# EAGLE design HeaterControl (EAGLE 9.2.0)
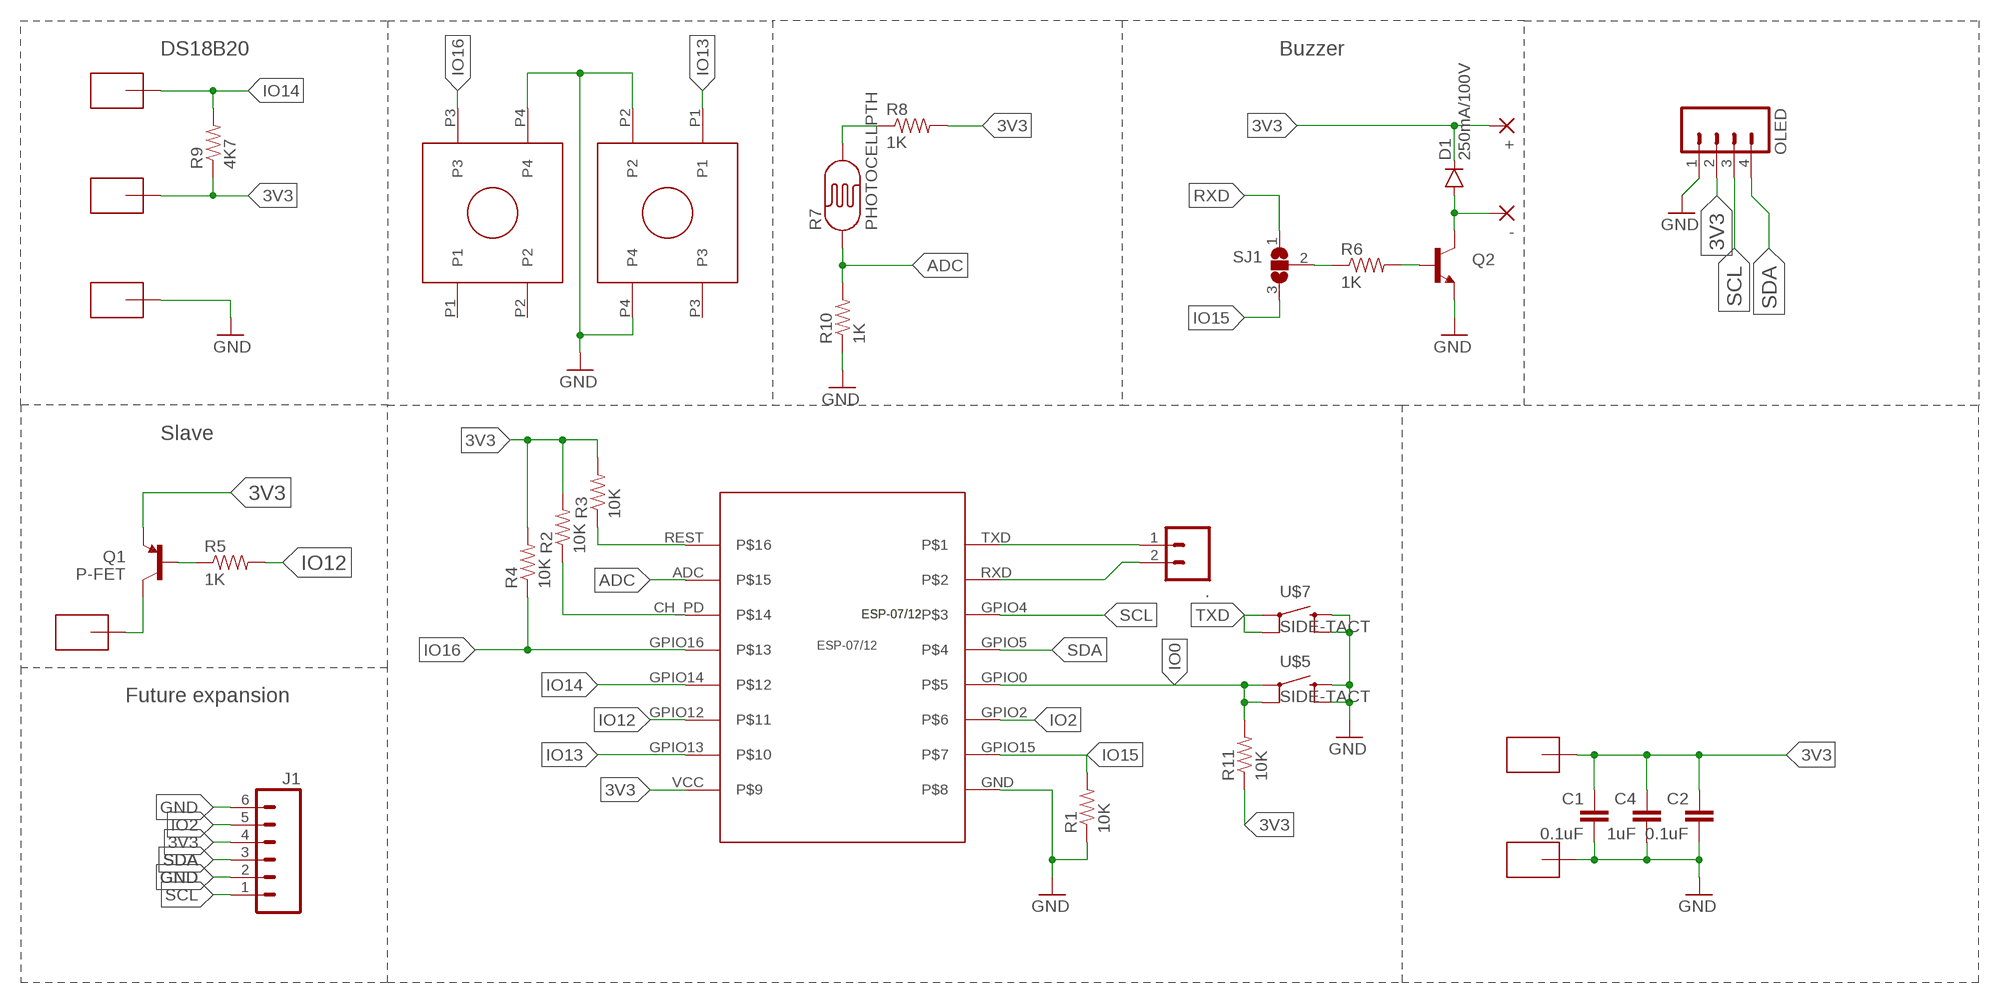
[diagram p0: schematic, sheet 1]

## Parts
+  1,6/0,8  [1,6/0,8]
-  1,6/0,8  [1,6/0,8]
.  M02PTH  [1X02]
C1  0.1uF  CAP  [0805-CAP]
C2  0.1uF  CAP  [0805-CAP]
C4  1uF  CAP  [0805-CAP]
D1  250mA/100V  DIODEBAS16  [SOD-323]
J1  M06SILK_FEMALE_PTH  [1X06]
LEFT  OMROM_TH  [OMROM_TH]
OLED  M04PTH  [1X04]
Q1  P-FET  TRANSISTOR_PNPSMD  [SOT23-3]
Q2  TRANSISTOR_NPNSOT23-3  [SOT23-3]
R1  10K  RESISTOR0805-RES  [0805]
R2  10K  RESISTOR0805-RES  [0805]
R3  10K  RESISTOR0805-RES  [0805]
R4  10K  RESISTOR0805-RES  [0805]
R5  1K  RESISTOR0805-RES  [0805]
R6  1K  RESISTOR0805-RES  [0805]
R7  PHOTOCELLPTH  [PHOTOCELL]
R8  1K  RESISTOR0805-RES  [0805]
R9  4K7  RESISTOR0805-RES  [0805]
R10  1K  RESISTOR0805-RES  [0805]
R11  10K  RESISTOR0805-RES  [0805]
RIGHT  OMROM_TH  [OMROM_TH]
SJ1  SJ2W  [SJ_2]
U$1  ESP-07/12  [ESP-07/12]
U$2  SMD-PAD1  [SMD-PAD1]
U$3  SMD-PAD1  [SMD-PAD1]
U$5  SIDE-TACT  [SIDE-TACT]
U$6  SMD-PAD1  [SMD-PAD1]
U$7  SIDE-TACT  [SIDE-TACT]
U$8  SMD-PAD1  [SMD-PAD1]
U$10  SMD-PAD1  [SMD-PAD1]
U$11  SMD-PAD1  [SMD-PAD1]

## Nets
3V3: +.1(P) C1.1 C2.1 C4.1 D1.C J1.4 OLED.2 Q1.2(E) R2.2 R3.2 R4.2 R8.2 R9.1 R11.1 U$1.VCC U$3.>NAME U$8.>NAME
ADC: R7.1 R10.2 U$1.ADC
GND: C1.2 C2.2 C4.2 J1.2 J1.6 LEFT.P4 OLED.1 Q2.2(E) R1.1 R10.1 RIGHT.P2 RIGHT.P4 U$1.GND U$5.3 U$5.4 U$6.>NAME U$7.3 U$7.4 U$11.>NAME
IO0: R11.2 U$1.GPIO0 U$5.1 U$5.2
IO2: J1.5 U$1.GPIO2
IO12: R5.2 U$1.GPIO12
IO13: RIGHT.P1 U$1.GPIO13
IO14: R9.2 U$1.GPIO14 U$10.>NAME
IO15: R1.2 SJ1.3 U$1.GPIO15
IO16: LEFT.P3 R4.1 U$1.GPIO16
N$1: Q1.3(C) U$2.>NAME
N$2: Q2.1(B) R6.2
N$4: -.1(P) D1.A Q2.3(C)
N$5: R7.2 R8.1
N$6: Q1.1(B) R5.1
N$8: R6.1 SJ1.2
N$11: R2.1 U$1.CH_PD
REST: R3.1 U$1.REST
RXD: ..2 SJ1.1 U$1.RXD
SCL: J1.1 OLED.3 U$1.GPIO4
SDA: J1.3 OLED.4 U$1.GPIO5
TXD: ..1 U$1.TXD U$7.1 U$7.2
Unconnected: LEFT.P1 LEFT.P2 RIGHT.P3

## Notes on the sheet
- DS18B20 | Buzzer
- Slave
- Future expansion

## Library data of the parts
+ - = wirepad:1,6/0,8: THROUGH-HOLE PAD
. = SparkFun-Connectors:M02: Standard 2-pin 0.1" header. Use with - straight break away headers ( PRT-00116) - right angle break away headers (PRT-00553) - swiss pins (PRT-00743) - machine pins (PRT-00117) - female headers (PRT-00115) Molex polarized connector foot print use with: PRT-08233 with associated crimp pins and housings. 2.54_SCREWTERM for use with PRT-10571. 3.5mm Screw Terminal footprints for PRT-08084 5mm Screw Terminal footprints for use with PRT-08432
C1 C2 C4 = SparkFun-Capacitors:CAP: Capacitor Standard 0603 ceramic capacitor, and 0.1" leaded capacitor.
D1 = SparkFun-DiscreteSemi:DIODE: Diode These are standard reverse protection diodes and small signal diodes. SMA package can handle up to about 1A. SOD-323 can handle about 200mA. What the SOD-323 package when ordering, there are some mfgs out there that are 5-pin packages.; PROD_ID: DIO-09646
J1 = SparkFun-Connectors:M06: Header 6 Standard 6-pin 0.1" header. Use with straight break away headers (SKU : PRT-00116), right angle break away headers (PRT-00553), swiss pins (PRT-00743), machine pins (PRT-00117), and female headers (PRT-00115). Molex polarized connector foot print use with SKU : PRT-08094 with associated crimp pins and housings. NOTES ON THE VARIANTS LOCK and LOCK_LONGPADS... This footprint was designed to help hold the alignment of a through-hole component (i.e. 6-pin header) while soldering it into place. You may notice that each hole has been shifted either up or down by 0.005 of an inch from it's more standard position (which is a perfectly straight line). This slight alteration caused the pins (the squares in the middle) to touch the edges of the holes. Because they are alternating, it causes a "brace" to hold the component in place. 0.005 has proven to be the perfect amount of "off-center" position when using our standard breakaway headers. Although looks a little odd when you look at the bare footprint, once you have a header in there, the alteration is very hard to notice. Also,if you push a header all the way into place, it is covered up entirely on the bottom side. This idea of altering the position of holes to aid alignment will be further integrated into the Sparkfun Library for other footprints. It can help hold any component with 3 or more connection pins.; PROD_ID: CONN-08437
LEFT RIGHT = CuriousTech:OMROM_TH: C&K KSA0M211 LFT + cap BTNK0120 (untested)
OLED = SparkFun-Connectors:M04: Header 4 Standard 4-pin 0.1" header. Use with straight break away headers (SKU : PRT-00116), right angle break away headers (PRT-00553), swiss pins (PRT-00743), machine pins (PRT-00117), and female headers (PRT-00115). Molex polarized connector foot print use with SKU : PRT-08231 with associated crimp pins and housings. 1MM SMD Version SKU: PRT-10208
Q1 = SparkFun-DiscreteSemi:TRANSISTOR_PNP: Generic PNP BJT Double check pinouts against datasheets- not all devices are the same! MMBT3906 - 40V 200mA SOT-23 (TRANS-08052) MMBT4403 - 40V 600mA SOT-23 (TRANS-09245)
Q2 = SparkFun-DiscreteSemi:TRANSISTOR_NPN: Generic NPN BJT MMBT2222A - TRANS-08049 (SOT-23, 1A 40V) MPSA42 - TRANS-09116 (SOT-23, 500mA 300V) MMBT5088LT1G - TRANS-11160 (SOT-23, 50 mA 30V) BC547 - COM-08928 <http://www.sparkfun.com/products/8928> (TO-92 45V 100mA) (1.Collector 2.Base 3.Emitter) 2N3904 - COM-00521 <http://www.sparkfun.com/products/521> (TO-92 40V 200mA) (1.Emitter 2.Base 3.Collector) P2N2222A - COM-12852 <http://www.sparkfun.com/products/12852> (TO-92 40V 600mA) (1.Collector 2.Base 3.Emitter); PROD_ID: TRANS-08049
R1-R6 R8-R11 = SparkFun-Resistors:RESISTOR: Resistor Basic schematic elements and footprints for 0603, 1206, and PTH resistors.
R7 = SparkFun-Sensors:PHOTOCELL: CdS photoresistor. This is a low cost way to detect light levels. Resistance decreases with more incoming light. SparkFun SKU: SEN-09088
SJ1 = jumper:SJ2W: SMD solder JUMPER
U$1 = ESP-07_12:ESP-07/12: Version 1.0 of the library for the ESP-07/12 full GPIO dev board module byME Jon jonnyradu@gmail.com
U$2 U$3 U$6 U$8 U$10 U$11 = CuriousTech:SMD-PAD1: SMD-PAD small
U$5 U$7 = CuriousTech:SIDE-TACT

## Board
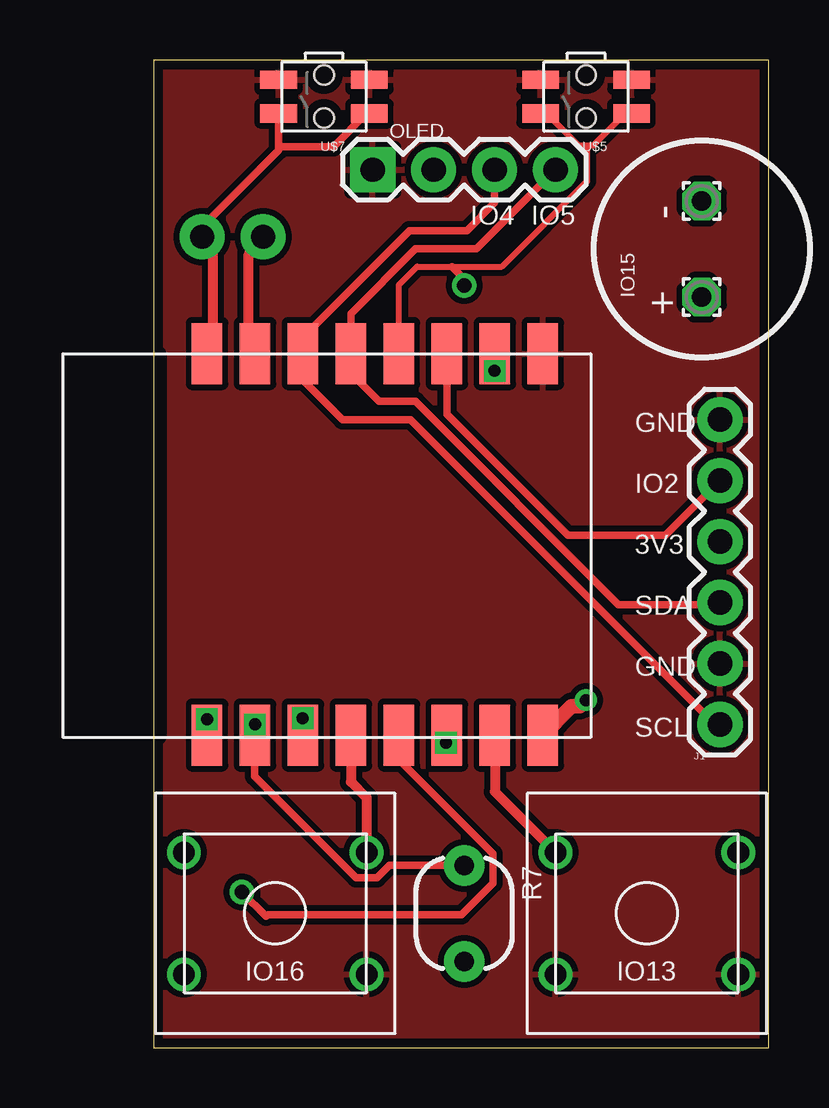
[diagram p1: board, top side]
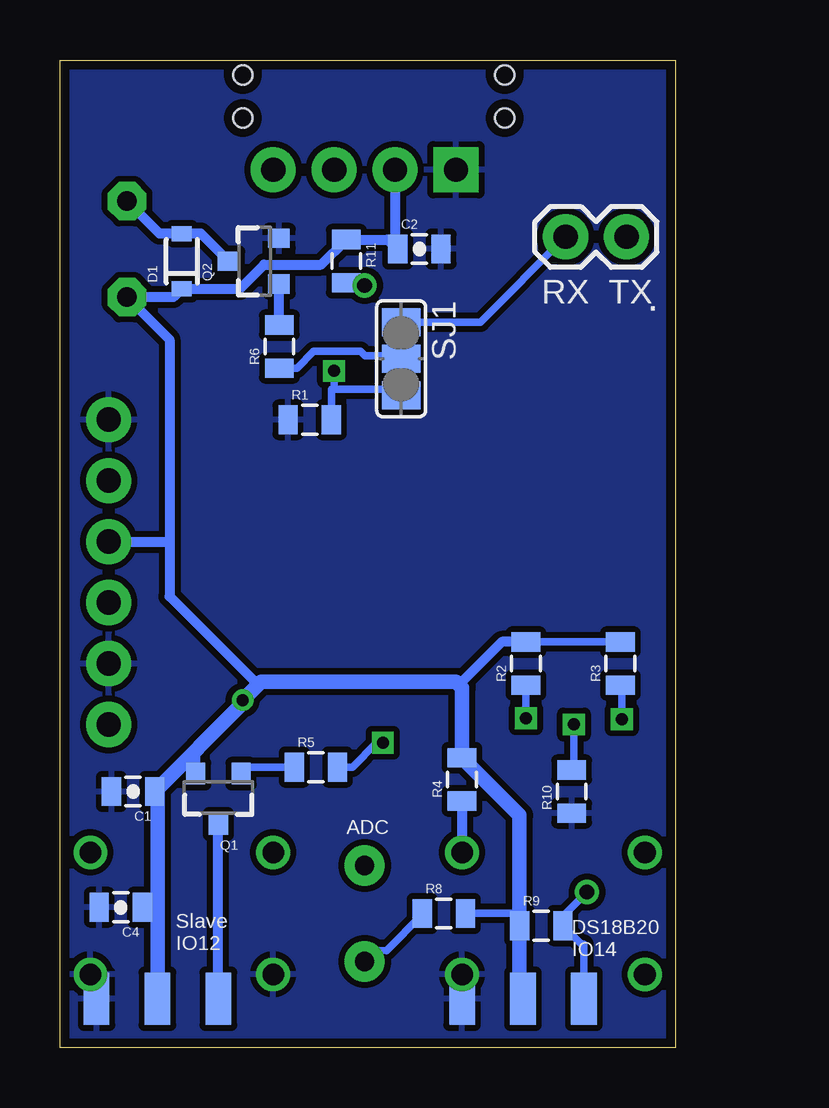
[diagram p2: board, bottom side, seen from below]

Size 25.65 x 41.15 mm. Coordinates in mm from the lower left corner, seen from the top.
Outline: 25.65,0 25.65,41.15 0,41.15 0,0 25.65,0
Copper layers (1*16): Top 0.035mm / dielectric 1.5mm / Bottom 0.035mm
Design rules "default *": minimum track width 10mil, minimum drill 24mil, track to track 8mil, track to pad 8mil, pad to pad 8mil, via to via 8mil, smd to smd 8mil, copper to edge 15mil, drill to drill 8mil, minimum pad ring 10mil, minimum via ring 8mil, stop-mask expansion 4mil, vias tented up to drill 0mil, thermal gap 10mil

### Footprints (pad centres in the part's own frame; a part is rotated, then mirrored left to right if it is on the bottom)
1,6/0,8 = drill 0.813 pad 1.6 octagon: 1 0,0
1X02 = drill 1.016 pad 1.88: 1 0,0; 2 2.54,0
0805-CAP = smd 0.8 x 1.2: 1 -0.9,0; 2 0.9,0
SOD-323 = smd 0.63 x 0.83: A 1.15,0; C -1.15,0
1X06 = drill 1.016 pad 1.88: 1 0,0; 2 2.54,0; 3 5.08,0; 4 7.62,0; 5 10.16,0; 6 12.7,0
OMROM_TH = drill 0.9: P1 -3.81,2.54; P2 -3.81,-2.54; P3 3.81,2.54; P4 3.81,-2.54
1X04 = drill 1.016 pad 1.88 square: 1 0,0 | drill 1.016 pad 1.88: 2 2.54,0; 3 5.08,0; 4 7.62,0
SOT23-3 = smd 0.8 x 0.9: 1 -0.95,-1; 2 0.95,-1; 3 0,1.1
0805 = smd 0.8 x 1.2: 1 -0.9,0; 2 0.9,0
PHOTOCELL = drill 0.8 pad 1.676: 1 -2,0; 2 2,0
SJ_2 = smd 1.168 x 1.6: 1 -1.524,0; 2 0,0; 3 1.524,0
ESP-07/12 = smd 2.54 x 1.27: ADC 0.1,14; CH_PD 0.1,12; GND 16,2; GPIO0 16,8; GPIO2 16,6; GPIO4 16,12; GPIO5 16,10; GPIO12 0.1,6; GPIO13 0.1,4; GPIO14 0.1,8; GPIO15 16,4; GPIO16 0.1,10; REST 0.1,16; RXD 16,14; TXD 16,16; VCC 0.1,2
SMD-PAD1 = smd 2.184 x 1.067: >NAME 0,0
SIDE-TACT = smd 1.524 x 0.762: 1 -1.894,0.705; 2 1.894,0.705; 3 -1.894,-0.705; 4 1.894,-0.705 | hole 0.8: 0,0.9; 0,-0.9

### Placement (x,y rotation side)
+  22.86,31.27 90 top
-  22.86,35.27 90 top
.  2.03,33.78 180 bottom
C1  22.61,10.67 180 bottom
C2  10.67,33.27 0 bottom
C4  23.11,5.84 180 bottom
D1  20.57,32.77 90 bottom
J1  23.62,13.46 90 top
LEFT  5.08,5.59 0 top
OLED  9.14,36.58 0 top
Q1  19.05,10.41 180 bottom
Q2  17.53,32.77 90 bottom
R1  15.24,26.16 0 bottom
R2  6.22,16 90 bottom
R3  2.29,16 90 bottom
R4  8.89,11.18 90 bottom
R5  14.99,11.68 0 bottom
R6  16.51,29.21 90 bottom
R7  12.95,5.59 270 top
R8  9.65,5.59 0 bottom
R9  5.59,5.08 0 bottom
R10  4.32,10.67 90 bottom
R11  13.72,32.77 270 bottom
RIGHT  20.57,5.59 0 top
SJ1  11.43,28.7 270 bottom
U$1  18.23,12.92 90 top
U$2  19.05,2.03 270 bottom
U$3  21.59,2.03 270 bottom
U$5  18.03,39.62 180 top
U$6  24.13,2.03 270 bottom
U$7  7.11,39.62 180 top
U$8  6.35,2.03 90 bottom
U$10  3.81,2.03 270 bottom
U$11  8.89,2.03 270 bottom

### Tracks (layer width: path | path; a pad name or v marks a point on that pad's centre or on a via)
3V3  (via drill 0.5)
  Top 0.61: v18.03,14.48 17.78,14.22 17.44,14.22 U$1.VCC
  Bottom 0.305: C4.1 21.59,5.84 21.59,5.59 | R3.2 R2.2 | R8.2 6.49,5.59
  Bottom 0.406: Q1.2 20,12.51 v18.03,14.48 | 11.62,33.29 11.68,33.3 OLED.2 | 11.62,33.29 C2.1 | R2.2 7.23,16.9 9.02,15.11 | 21.08,21.08 21.08,29.49 +.1 20.92,31.27 D1.C 18.15,31.62 17.14,32.62 14.76,32.62 R11.1 12,33.67 11.62,33.29 | 21.08,21.08 21.08,18.8 17.4,15.11 | J1.4 21.08,21.08
  Bottom 0.61: U$3.>NAME 21.59,5.59 21.59,10.67 C1.1 18.03,14.34 v18.03,14.48 17.4,15.11 17.27,15.24 9.14,15.24 9.02,15.11 8.89,14.99 R4.2 6.49,9.67 6.49,5.59 R9.1 6.49,2.03 U$8.>NAME
ADC  (via drill 0.5)
  Top 0.305: v4.23,13.46 U$1.ADC 4.22,11.3 8.45,7.07 9.33,7.07 9.85,7.59 R7.1
  Bottom 0.305: R10.2 4.23,11.61 v4.23,13.46
GND
  Bottom 0.406: U$6.>NAME 24.13,2.54 RIGHT.P4
  pour Top (isolate 0.254): 0,0 0,41.15 25.65,41.15 25.65,0
  pour Bottom (isolate 0.254): 25.65,0 0,0 0,41.15 25.65,41.15
IO0  (via drill 0.61)
  Top 0.254: U$1.GPIO0 10.23,31.77 10.99,32.54 12.45,32.54 14.52,32.54 18.07,36.09 18.07,37.59 | U$5.1 19.67,38.92 18.35,37.59 18.07,37.59 | 18.07,37.59 17.72,37.59 16.39,38.92 U$5.2
  Top 0.305: 12.45,32.54 12.95,32.03 v12.95,31.75
  Bottom 0.305: R11.2 13.07,31.87 v12.95,31.75
IO2
  Top 0.305: U$1.GPIO2 12.23,26.38 17.27,21.34 21.34,21.34 J1.5
IO12  (via drill 0.5)
  Top 0.305: v12.19,12.7 12.23,12.73 U$1.GPIO12
  Bottom 0.305: v12.19,12.7 12.45,12.7 13.46,11.68 R5.2
IO13
  Top 0.406: U$1.GPIO13 14.23,10.66 RIGHT.P1
IO14  (via drill 0.61)
  Top 0.305: U$1.GPIO14 10.23,12 14.15,8.08 14.15,6.84 12.84,5.54 4.78,5.54 4.7,5.46 v3.68,6.48
  Bottom 0.305: U$10.>NAME 3.81,4.3 3.95,4.34 R9.2 4.69,5.47 v3.68,6.48
IO15  (via drill 0.5)
  Top 0.305: U$1.GPIO15 v14.23,28.19 v14.22,28.19
  Bottom 0.305: 14.34,27.43 R1.2 | 14.34,27.43 11.68,27.43 SJ1.3 | 14.34,27.43 14.22,27.55 v14.22,28.19
IO16
  Top 0.406: U$1.GPIO16 8.23,11.07 8.89,10.41 LEFT.P3
  Bottom 0.406: R4.1 LEFT.P3
N$1
  Bottom 0.406: U$2.>NAME 19.05,9.14 Q1.3
N$2
  Bottom 0.406: R6.2 16.51,31.8 Q2.1
N$4
  Bottom 0.406: -.1 21.51,33.92 D1.A 19.78,33.92 Q2.3
N$5
  Bottom 0.305: R8.1 10.55,5.52 12.04,4.03 12.49,4.05 R7.2
N$6
  Bottom 0.305: Q1.1 18.05,11.41 17.78,11.68 R5.1
N$8
  Bottom 0.305: R6.1 15.77,28.31 15.08,29 13.12,29 12.93,28.82 11.55,28.82 SJ1.2
N$11  (via drill 0.5)
  Top 0.305: v6.22,13.72 6.35,13.08 6.29,13.02
  Top 0.406: 6.29,13.02 U$1.CH_PD
  Bottom 0.305: R2.1 v6.22,13.72
REST  (via drill 0.5)
  Top 0.305: U$1.REST 2.23,13.46
  Top 0.406: 2.23,13.46 v2.23,13.68
  Bottom 0.305: R3.1 2.29,14.99 2.23,14.93 v2.23,13.68
RXD
  Top 0.406: ..2 3.98,33.05 3.98,29.17 U$1.RXD
  Bottom 0.305: SJ1.1 8.13,30.23 ..2
SCL
  Top 0.305: OLED.3 14.22,35.19 13.07,34.04 10.67,34.04 6.23,29.6 U$1.GPIO4 6.23,27.81 7.87,26.16 10.71,26.16 23.41,13.46 J1.1
SDA
  Top 0.305: OLED.4 13.46,33.27 10.92,33.27 8.23,30.58 U$1.GPIO5 8.23,28.09 9.4,26.92 10.92,26.92 19.39,18.45 23.53,18.45 J1.3
TXD
  Top 0.305: ..1 2.03,34.21 5.22,37.4 U$7.2 5.22,37.65 5.33,37.54 7.5,37.54 8.88,38.92 U$7.1
  Top 0.406: ..1 2.48,33.33 2.48,29.17 U$1.TXD

### Text on the board
tPlace: IO4 | IO5 | IO15 | GND | IO2 | 3V3 | SDA | GND | SCL | IO16 | IO13
bPlace: RX TX | ADC | DS18B20 / IO14 | Slave / IO12
tStop: ESP-07
bStop: CuriousTech.net | WiFi Smart | Waterbed Heater